# EAGLE design MastModule_v8 (EAGLE 9.6.2)
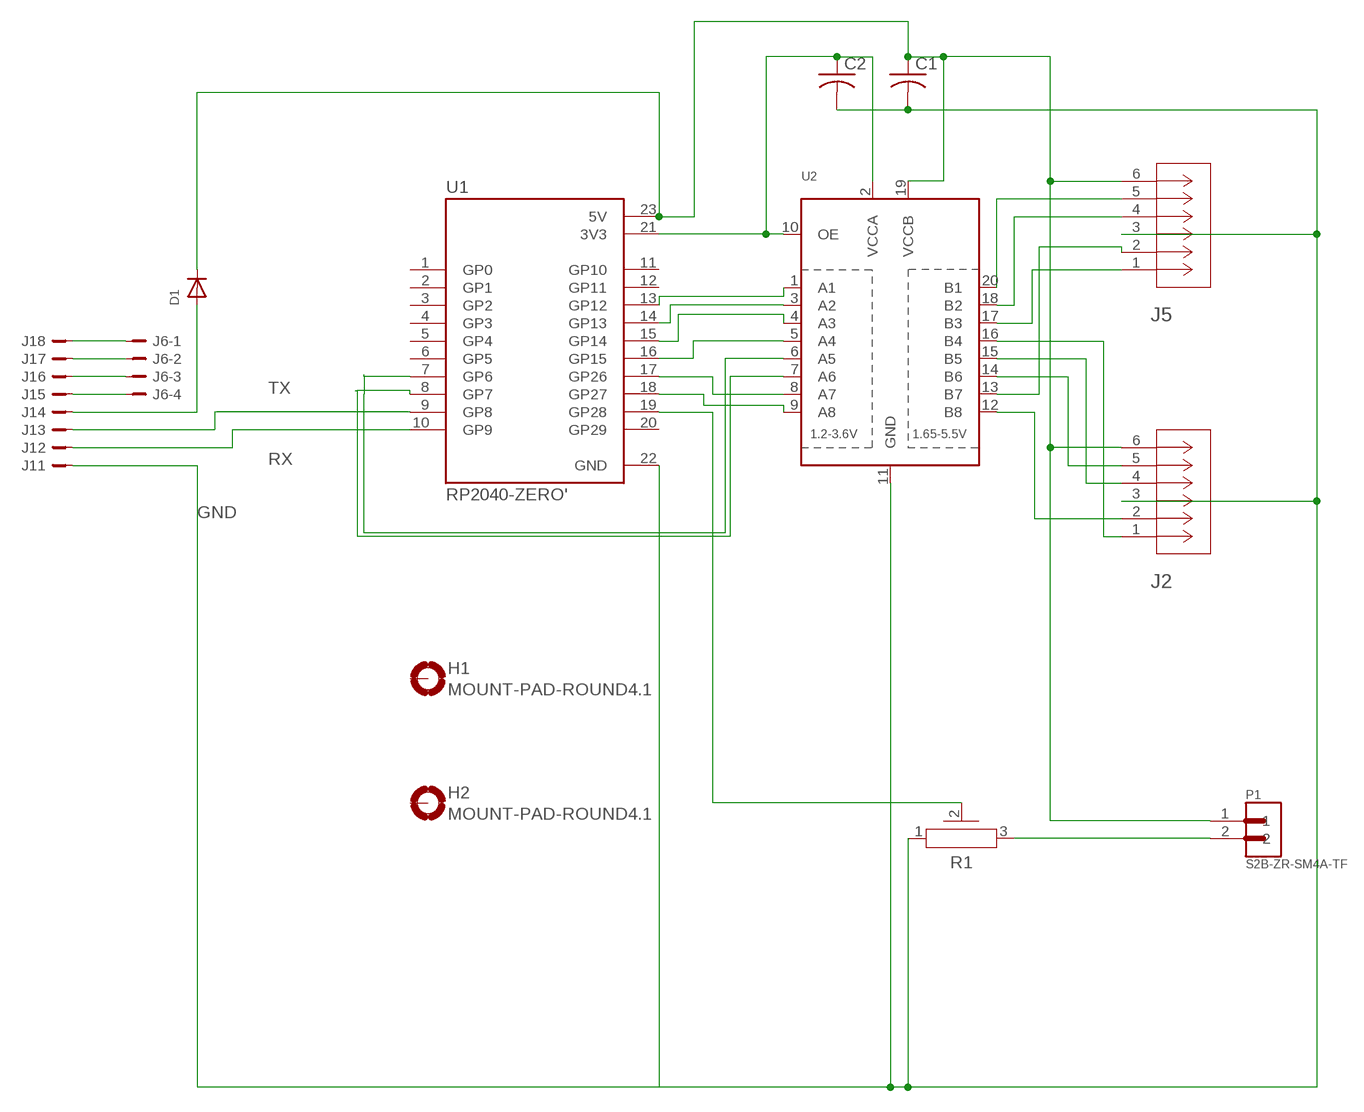
[diagram p0: schematic, sheet 1]

## Parts
C1  C-USC1210  [C1210]
C2  C-USC1210  [C1210]
D1  DIODESMA  [SMADIODE]
H1  MOUNT-PAD-ROUND4.1  [4,1-PAD]
H2  MOUNT-PAD-ROUND4.1  [4,1-PAD]
J1  B8B-PH-K-S  [B8B-PH-K-S]
J2  2132260630CONN_2132260000-SD_06_MOL  [CONN_2132260000-SD_06_MOL]
J5  2132260630CONN_2132260000-SD_06_MOL  [CONN_2132260000-SD_06_MOL]
J6  JST-PH-4_TH-RA  [S4B-PH-KL]
P1  S2B-ZR-SM4A-TF  [JST_S2B-ZR-SM4A-TF]
R1  PV36X  [PV36X]
U1  RP2040-ZERO'  [MODULE_RP2040-ZERO]
U2  TXB0108PWR  [TSSOP20]

## Nets
3V3: C2.1 U1.21(3V3) U2.2(VCCA) U2.10(OE)
5V: C1.1 D1.C J2.6 J5.6 P1.1 U1.23(5V) U2.19(VCCB)
GND: C1.2 C2.2 J1.1 J2.3 J5.3 R1.1 U1.22(GND) U2.11(GND)
N$1: J1.8 J6.1
N$2: J1.7 J6.2
N$3: J1.6 J6.3
N$4: J1.5 J6.4
N$6: D1.A J1.4
N$7: U1.17(GP26) U2.8(A7)
N$8: J5.5 U2.20(B1)
N$9: J5.4 U2.18(B2)
N$10: R1.2 U1.19(GP28)
N$11: P1.2 R1.3
N$12: J5.1 U2.17(B3)
N$13: J2.1 U2.16(B4)
N$14: J2.4 U2.15(B5)
N$15: J2.5 U2.14(B6)
N$16: U1.18(GP27) U2.9(A8)
N$17: J5.2 U2.13(B7)
N$18: J2.2 U2.12(B8)
N$21: U1.8(GP7) U2.7(A6)
N$22: U1.7(GP6) U2.6(A5)
N$23: U1.13(GP12) U2.1(A1)
N$24: U1.14(GP13) U2.3(A2)
N$25: U1.15(GP14) U2.4(A3)
N$26: U1.16(GP15) U2.5(A4)
RX: J1.2 U1.10(GP9)
TX: J1.3 U1.9(GP8)
Unconnected: H1.B4,1(MOUNT) H2.B4,1(MOUNT) U1.1(GP0) U1.2(GP1) U1.3(GP2) U1.4(GP3) U1.5(GP4) U1.6(GP5) U1.11(GP10) U1.12(GP11) U1.20(GP29)

## Library data of the parts
C1 C2 = adafruit:C-US: CAPACITOR, American symbol
D1 = adafruit:DIODE: Diode SMADIODE - SMA Surface Mount Package 20V 1A Schottky Diode Digikey: 641-1014-6-ND DO-1N4148 - Through Hole Small Current Diode SOD-123 20V 1 A (.5mV Vf) Schottky Diode - Digikey: MBRX120TPMSCT-ND SOD-323 10V 570mA (.38mV Vf, 3ns) Schottky Diode - Digikey: ZLLS410CT-ND SOD-523 30V 30mA Schottky Diode (RB751S-40TE61) - Digikey: RB751S-40TE61CT-ND SOT23-R/W - SOT23 Package (R = Solder Paste/Reflow Ovens, W = Hand-Soldering) BAT54Film 40V 300mA - Digikey: 497-7162-1-ND
H1 H2 = holes:MOUNT-PAD-ROUND: MOUNTING PAD, round
J1 = con-JST-PH:B8B-PH-K-S: JST-PH 8-way vertical TH
J2 J5 = 2025-10-01_21-18-46_Library:2132260630; COPYRIGHT: Copyright (C) 2025 Ultra Librarian. All rights reserved.; DATASHEET: https://www.molex.com/en-us/products/part-detail-pdf/2132260630?display=pdf; DESCRIPTION: 1.50mm Pitch CLIK-Mate Wire-to-Board PCB Receptacle, Single Row, Surface Mount, Right-Angle, 0.38µm Gold (Au) Plating, 6 Circuits, Natural; MANUFACTURER_NAME: Molex Connector Corporation; MANUFACTURER_PART_NUMBER: 2132260630
J6 = con-JST-PH:JST-PH-4; MF: JST; MPN: S4B-PH-KL
P1 = S2B-ZR-SM4A-TF:S2B-ZR-SM4A-TF: Check availability <https://pricing.snapeda.com/parts/S2B-ZR-SM4A-TF/JST%20Sales/view-part?ref=eda>; AVAILABILITY: In Stock; CHECK_PRICES: https://www.snapeda.com/parts/S2B-ZR-SM4A-TF/JST/view-part/?ref=eda; DESCRIPTION: Connector Header Surface Mount, Right Angle 2 position 0.059 (1.50mm); MF: JST Sales; MP: S2B-ZR-SM4A-TF; PACKAGE: None; PRICE: None; SNAPEDA_LINK: https://www.snapeda.com/parts/S2B-ZR-SM4A-TF/JST/view-part/?ref=snap
R1 = Resistor:PV36: Rectangular Trimmer Potentiometers - PV36 Series Reference: Datasheet <https://www.bourns.com/docs/Product-Datasheets/pv36.pdf>; CATEGORY: Potentiometers; DATASHEET: https://www.bourns.com/docs/Product-Datasheets/pv36.pdf; DESCRIPTION: 0.5W 1/2W PC Pins Through Hole Trimmer Potentiometer Cermet 25.0 Turn Side Adjustment; MANUFACTURER: Bourns Inc.; MPN: PV36Xx; OPERATING_TEMPERATURE: -55°C ~ 125°C; PACKAGE_SIZE: NA; PACKAGE_TYPE: THT; PART_STATUS: ACTIVE; ROHS: COMPLIANT; SERIES: PV36; SUBCATEGORY: Trimmer Potentiometers; TEMPERATURE_COEFFICIENT: ±100ppm/°C; THERMALLOSS: 0.5 W; TOLERANCE: ±10%; TYPE: Side Adjustment Inline Leads
U1 = RP2040-ZERO:RP2040-ZERO: Check availability <https://pricing.snapeda.com/parts/RP2040-ZERO/Waveshare%20Electronics/view-part?ref=eda>; AVAILABILITY: Not in stock; CHECK_PRICES: https://www.snapeda.com/parts/RP2040-ZERO/Waveshare+Electronics/view-part/?ref=eda; DESCRIPTION: Low-Cost, High-Performance Pico-Like MCU Board Based On Raspberry Pi Microcontroller RP2040; MF: Waveshare Electronics; MP: RP2040-ZERO; PACKAGE: Package; PRICE: None; SNAPEDA_LINK: https://www.snapeda.com/parts/RP2040-ZERO/Waveshare+Electronics/view-part/?ref=snap
U2 = adafruit:TXB0108PWR: 8-Bit Bi-Directional Level Shifter 1.2V-3.6V (VCCA) to 1.65V-5.5V (VCCB) bi-directional level shifter with auto direction sensing. Max data rate - VCCA 1.8V: 20Mbps (50ns), VCCA 3.3V: 100Mbps (10ns) Digikey: 296-21527-1-ND

## Board
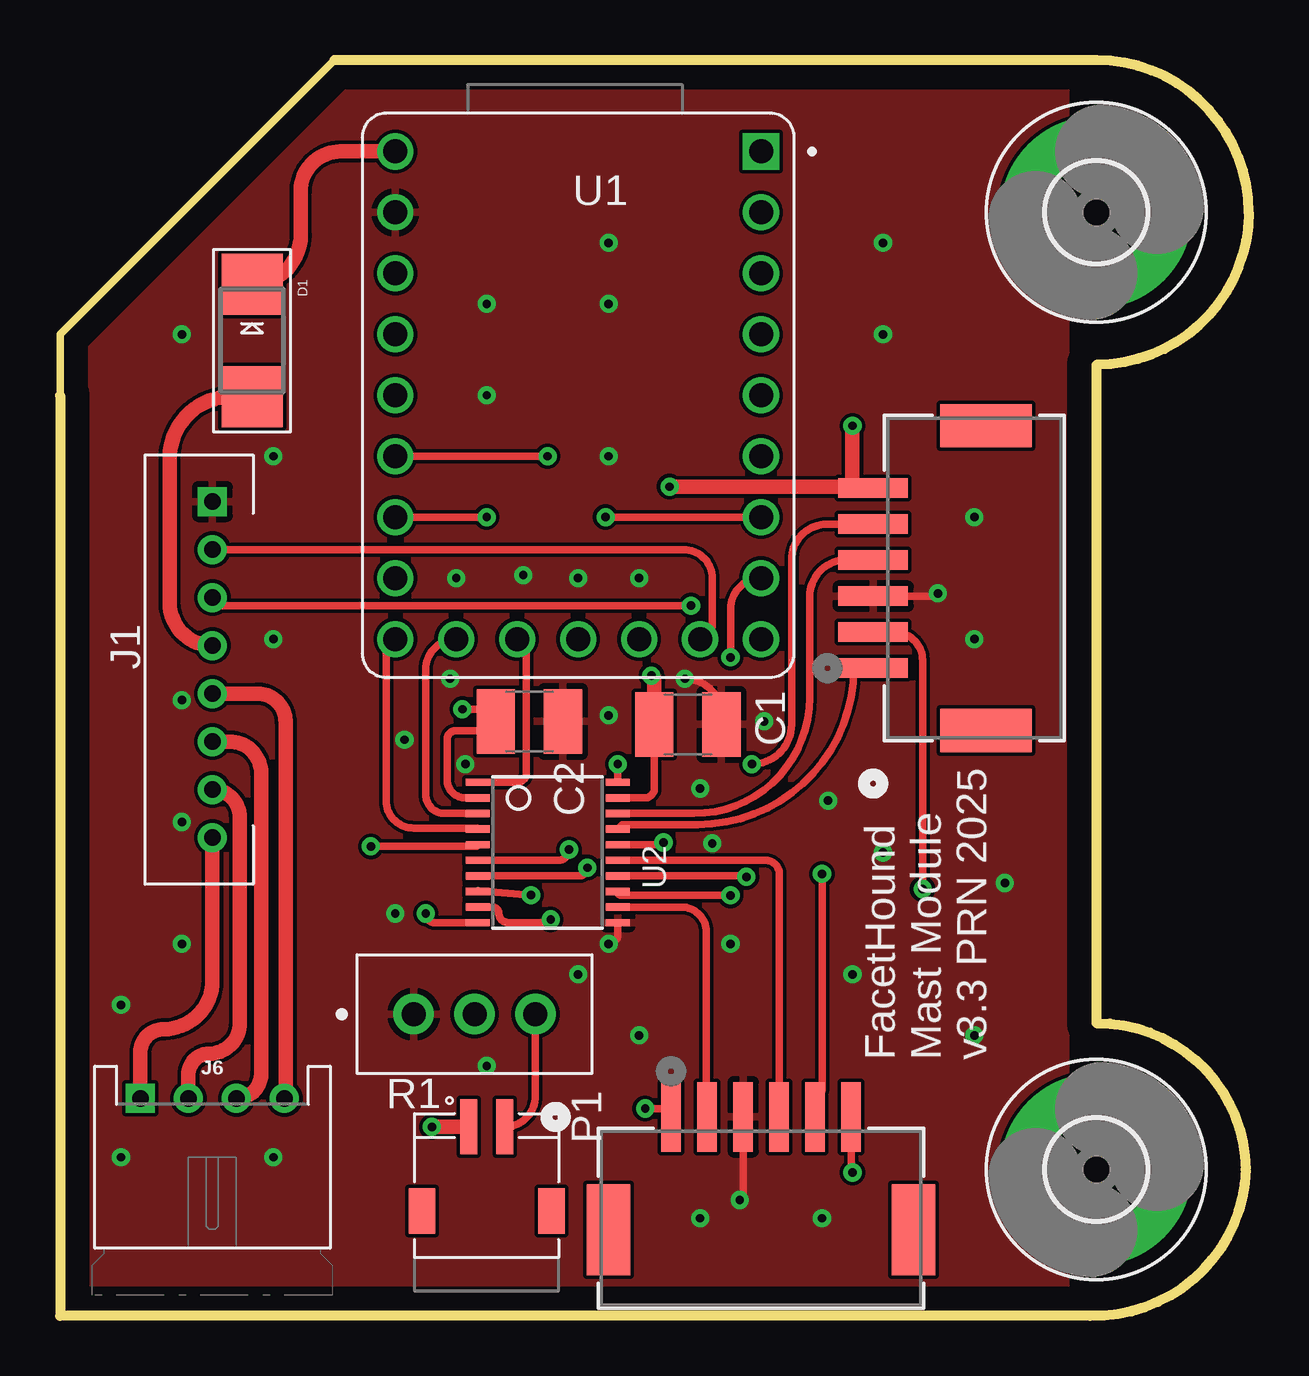
[diagram p1: board, top side]
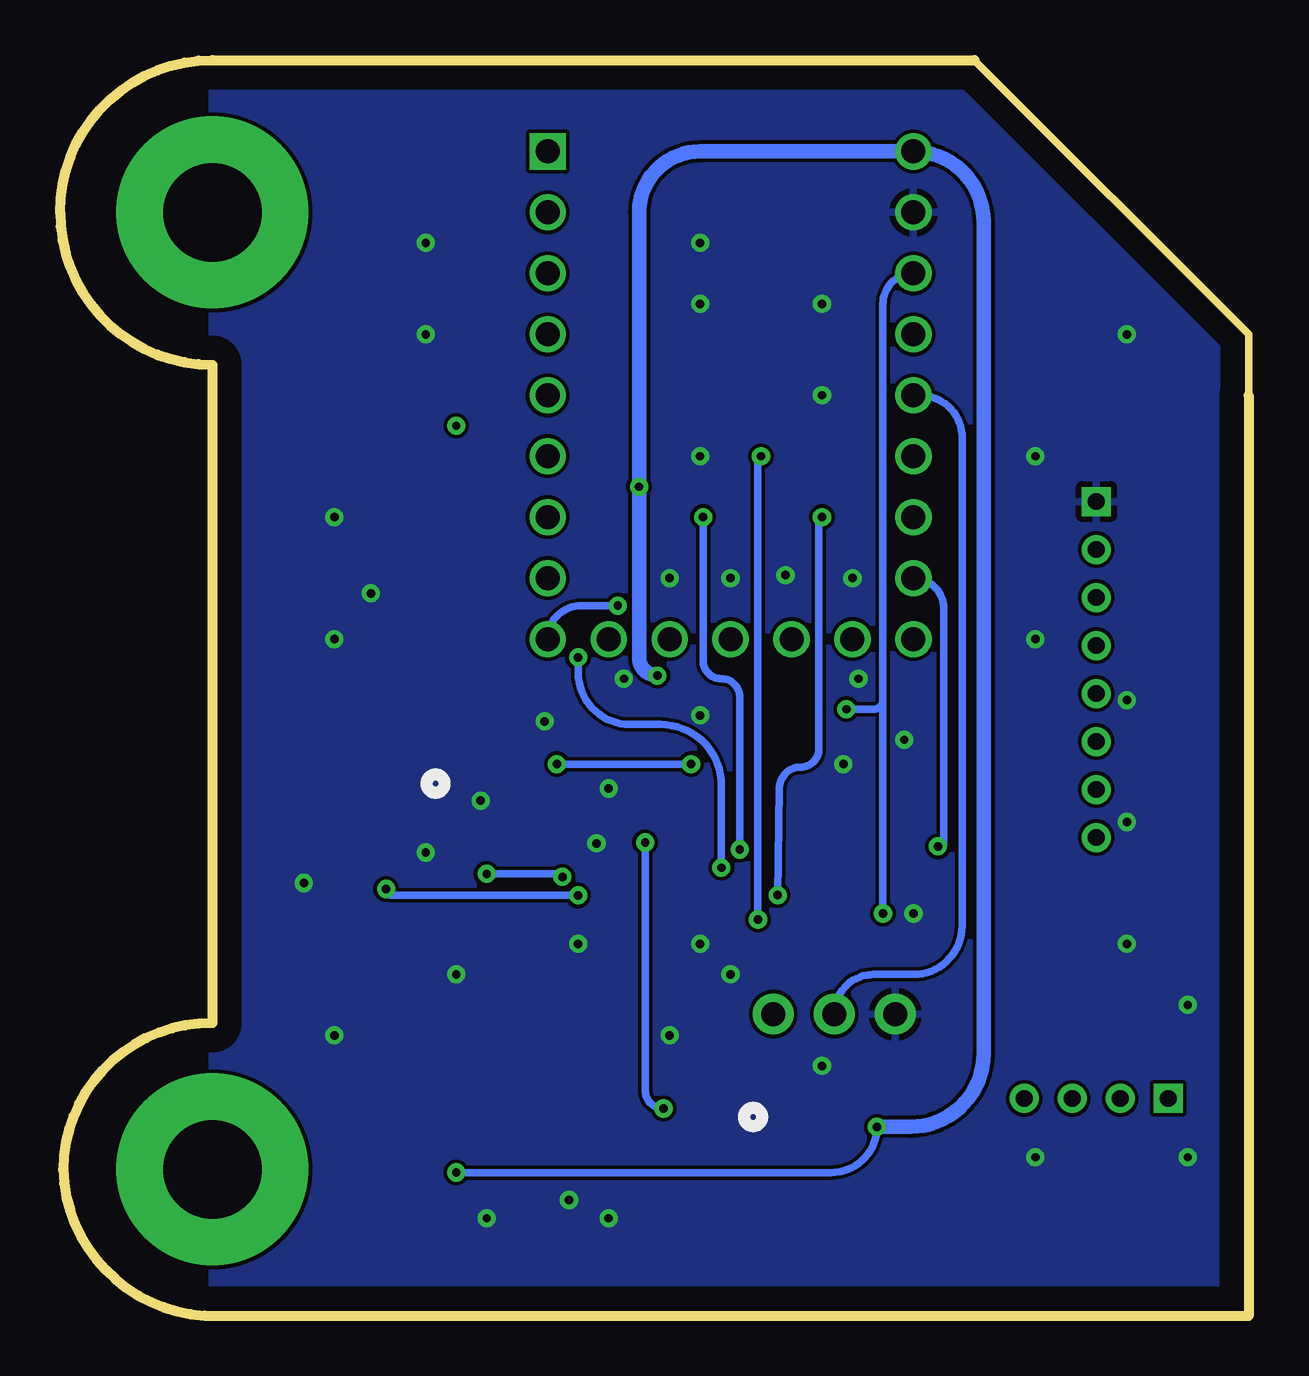
[diagram p2: board, bottom side, seen from below]

Size 49.53 x 52.32 mm. Coordinates in mm from the lower left corner, seen from the top.
Outline: 0,38.35 0,0 42.93,0 arc90 49.4,6.1 arc90 43.18,12.19 43.18,39.62 arc90 49.53,45.97 arc90 43.18,52.32 11.43,52.32 0,40.89 0,38.35
Copper layers (1*16): Top 0.035mm / dielectric 1.5mm / Bottom 0.035mm
Design rules "default": minimum track width 6mil, minimum drill 0.35mm, track to track 6mil, track to pad 6mil, pad to pad 6mil, via to via 6mil, smd to smd 6mil, copper to edge 40mil, drill to drill 6mil, minimum pad ring 10mil, minimum via ring 8mil, stop-mask expansion 4mil, vias tented up to drill 0mil, thermal gap 10mil

### Footprints (pad centres in the part's own frame; a part is rotated, then mirrored left to right if it is on the bottom)
C1210 = smd 1.6 x 2.7: 1 -1.4,0; 2 1.4,0
SMADIODE = smd 2.54 x 2.54: A 2.349,0; C -2.349,0
4,1-PAD = drill 4.1 pad 8: B4,1 0,0
B8B-PH-K-S = drill 0.7 square: 1 7,0 | drill 0.7: 2 5,0; 3 3,0; 4 1,0; 5 -1,0; 6 -3,0; 7 -5,0; 8 -7,0
CONN_2132260000-SD_06_MOL = smd 0.813 x 2.896: 1 -3.75,4.22; 2 -2.25,4.22; 3 -0.75,4.22; 4 0.75,4.22; 5 2.25,4.22; 6 3.75,4.22 | smd 1.803 x 3.81: 7 -6.35,-0.48; 8 6.35,-0.48
S4B-PH-KL = drill 0.7 square: 1 3,-3.72 | drill 0.7: 2 1,-3.72; 3 -1,-3.72; 4 -3,-3.72
JST_S2B-ZR-SM4A-TF = smd 0.7 x 2.3: 1 0.75,0; 2 -0.75,0 | smd 1.1 x 1.9: P1 2.7,3.5; P2 -2.7,3.5
PV36X = drill 1 pad 1.7: 1 0,0; 2 2.54,0; 3 5.08,0
MODULE_RP2040-ZERO = drill 1 square: 1 7.62,10.16 | drill 1: 2 7.62,7.62; 3 7.62,5.08; 4 7.62,2.54; 5 7.62,0; 6 7.62,-2.54; 7 7.62,-5.08; 8 7.62,-7.62; 9 7.62,-10.16; 10 5.08,-10.16; 11 2.54,-10.16; 12 0,-10.16; 13 -2.54,-10.16; 14 -5.08,-10.16; 15 -7.62,-10.16; 16 -7.62,-7.62; 17 -7.62,-5.08; 18 -7.62,-2.54; 19 -7.62,0; 20 -7.62,2.54; 21 -7.62,5.08; 22 -7.62,7.62; 23 -7.62,10.16
TSSOP20 = smd 0.305 x 0.991: 1 -2.925,-2.918; 2 -2.275,-2.918; 3 -1.625,-2.918; 4 -0.975,-2.918; 5 -0.325,-2.918; 6 0.325,-2.918; 7 0.975,-2.918; 8 1.625,-2.918; 9 2.275,-2.918; 10 2.925,-2.918; 11 2.925,2.918; 12 2.275,2.918; 13 1.625,2.918; 14 0.975,2.918; 15 0.325,2.918; 16 -0.325,2.918; 17 -0.975,2.918; 18 -1.625,2.918; 19 -2.275,2.918; 20 -2.925,2.918

### Placement (x,y rotation side)
C1  26.16,24.64 0 top
C2  19.56,24.77 0 top
D1  8,40.64 270 top
H1  43.18,45.97 0 top
H2  43.18,6.1 0 top
J1  6.35,26.92 90 top
J2  29.21,4.06 0 top
J5  38.1,30.73 90 top
J6  6.35,5.33 180 top
P1  17.78,7.87 180 top
R1  14.73,12.57 0 top
U1  21.59,38.35 0 top
U2  20.32,19.3 270 top

### Tracks (layer width: path | path; a pad name or v marks a point on that pad's centre or on a via)
3V3  (via drill 0.35)
  Top 0.305: U2.2 16.9,21.58 arc-90 16.13,22.35 16.13,24 arc-90 16.51,24.38 17.78,24.38 arc90 C2.1 arc90 17.65,25.27 v16.76,25.27 | v15.24,16.76 arc90 15.62,16.38 U2.10
  Bottom 0.305: U1.21 arc-90 15.24,42.16 15.24,25.65 | 15.24,25.65 arc90 15.62,25.27 v16.76,25.27 | 15.24,25.65 v15.24,16.76
5V  (via drill 0.35)
  Top 0.305: v33.02,5.97 arc-90 32.96,6.03 J2.6 | U2.19 24.37,21.58 arc90 24.77,21.97 C1.1 arc90 C1.1
  Top 0.61: v15.49,7.87 P1.1 | v33.02,37.08 33.02,34.54 arc90 33.08,34.48 J5.6 arc90 33.82,34.54 v25.4,34.54 | D1.C arc90 10.03,45.02 10.03,46.86 arc-90 11.68,48.51 U1.23 | C1.1 24.76,26.55 | 24.76,26.55 arc90 v24.64,26.67 arc-90 24.76,26.55
  Bottom 0.305: v15.49,7.87 arc90 17.4,5.97 v33.02,5.97
  Bottom 0.61: v15.49,7.87 14.1,7.87 arc-90 11.05,10.92 11.05,45.59 arc-90 U1.23 22.86,48.51 arc-90 25.4,45.97 v25.4,34.54 25.4,34.16 25.4,27.43 arc-90 v24.64,26.67
GND  (via drill 0.35)
  Top 0.305: 34.54,29.97 33.89,29.97 arc-90 J5.3 36.46,29.98 arc90 v36.58,30.1 | U2.11 23.24,15.87 arc-90 v22.86,15.49 | J2.3 28.46,4.97 arc-90 v28.32,4.83 | C2.2 arc90 21.34,25.14 | C1.2 27.56,25.02 arc90 v26.04,26.54
  other vias: 34.29,44.7 34.29,40.89 17.78,42.16 22.86,42.16 22.86,44.7 17.78,38.35 8.89,35.81 5.08,40.89 22.86,35.81 8.89,28.19 5.08,25.65 5.08,20.57 5.08,15.49 2.54,12.95 2.54,6.6 8.89,6.6 13.97,16.76 17.78,10.41 24.13,11.68 21.59,14.22 27.94,15.49 26.67,4.06 31.75,4.06 33.02,14.22 38.1,11.68 39.37,18.03 34.29,19.3 38.1,28.19 38.1,33.27 29.34,24.77 22.86,25.02 16.51,30.73 19.3,30.86 21.59,30.73 24.13,30.73 16.26,26.54 16.89,22.99 32,21.46 26.67,21.97 27.18,19.68 14.35,24
  pour Bottom: 11.43,52.32 0,40.89 0,0.25 43.18,0.25 43.18,52.32
  pour Top: 0,40.89 11.43,52.32 41.91,52.32 41.91,0.25 0,0.25
N$1
  Top 0.61: J1.8 6.35,13.97 arc-90 4.32,11.94 arc90 3.35,10.97 J6.1
N$2
  Top 0.61: J1.7 arc-90 7.49,20.78 7.49,12.19 arc-90 6.22,10.92 arc90 5.35,10.05 J6.2
N$3
  Top 0.61: J1.6 7.06,23.92 arc-90 8.38,22.61 8.38,10.09 arc-90 J6.3
N$4
  Top 0.61: J1.5 8.24,25.92 arc-90 9.4,24.77 9.4,9.1 arc-90 J6.4
N$6
  Top 0.61: J1.4 arc-90 4.57,29.7 4.57,35.75 arc-90 7.11,38.29 D1.A
N$7  (via drill 0.35)
  Top 0.305: U1.17 v17.78,33.27 | v19.63,17.53 17.44,17.71 arc90 U2.8
  Bottom 0.305: v17.78,33.27 arc-90 17.91,33.15 17.91,23.62 arc90 18.67,22.86 arc-90 19.56,21.97 v19.63,17.53
N$8  (via drill 0.35)
  Top 0.305: J5.5 31.97,32.98 arc90 30.48,31.5 30.48,24.64 arc-90 v28.83,22.99 | U2.20 v23.24,22.98 arc-90 v23.24,22.99
  Bottom 0.305: v23.24,22.99 v28.83,22.99
N$9
  Top 0.305: J5.4 arc90 33.87,31.5 32.77,31.5 arc90 31.24,29.97 31.24,25.75 arc-90 26.42,20.93 U2.18
N$10
  Bottom 0.305: U1.19 13.72,38.35 arc90 11.94,36.58 11.94,16.26 arc90 13.97,14.22 15.62,14.22 arc-90 R1.2
N$11
  Top 0.305: P1.2 arc90 19.81,9.16 R1.3
N$12
  Top 0.305: U2.17 23.43,20.47 26.57,20.47 arc90 33.08,26.98 J5.1
N$13  (via drill 0.35)
  Top 0.305: v25.15,19.72 25.05,19.63 U2.16 | v24.38,8.64 25.11,8.64 arc-90 J2.1
  Bottom 0.305: v25.15,19.72 25.15,9.4 arc-90 v24.38,8.64
N$14
  Top 0.305: U2.15 23.17,18.98 | U2.15 23.44,18.98 | J2.4 arc90 29.97,8.3 29.97,18.41 arc90 29.41,18.98 U2.15
N$15  (via drill 0.35)
  Top 0.305: 31.37,8.37 arc90 J2.5 arc90 31.5,8.32 31.5,9.14 31.75,9.4 v31.75,18.41 | U2.14 28.56,18.33 arc-90 v28.6,18.29
  Bottom 0.305: v31.75,18.41 28.73,18.41 v28.6,18.29
N$16  (via drill 0.35)
  Top 0.305: U1.18 v20.32,35.81 | U2.9 18.02,17.03 arc-90 18.29,16.76 arc90 18.67,16.38 20.32,16.38 arc90 v20.45,16.51
  Bottom 0.305: v20.32,35.81 20.45,35.69 v20.45,16.51
N$17  (via drill 0.35)
  Top 0.305: 35.14,28.48 34.76,28.48 | v35.94,17.78 35.94,27.3 arc90 34.76,28.48 | 34.76,28.48 J5.2 | U2.13 arc90 23.4,17.52 v27.94,17.52
  Bottom 0.305: v27.94,17.52 35.68,17.52 arc90 v35.94,17.78
N$18
  Top 0.305: U2.12 25.9,17.03 arc-90 26.92,16 26.92,8.32 arc90 J2.2
N$21  (via drill 0.35)
  Top 0.305: U1.8 arc90 27.94,29.46 v27.94,27.43 | U2.7 21.63,18.33 arc90 v21.97,18.67
  Bottom 0.305: v21.97,18.67 21.97,21.84 21.97,22.1 arc-90 24.51,24.64 25.78,24.64 arc90 27.94,26.8 v27.94,27.43
N$22  (via drill 0.35)
  Top 0.305: U2.6 20.76,18.98 arc90 v21.21,19.43 | v22.73,33.27 U1.7
  Bottom 0.305: v21.21,19.43 21.21,25.78 arc-90 21.97,26.54 arc90 22.73,27.3 v22.73,33.27
N$23
  Top 0.305: U2.1 arc90 U2.1 19.05,22.23 arc90 19.43,22.61 19.43,27.81 arc90 U1.13
N$24
  Top 0.305: U1.14 arc90 15.24,26.92 15.24,21.72 arc90 16.03,20.93 U2.3
N$25
  Top 0.305: U1.15 13.59,27.81 13.59,21.46 arc90 14.73,20.32 17.36,20.32 arc-90 U2.4
N$26  (via drill 0.35)
  Top 0.305: U2.5 arc-90 17.33,19.56 v12.95,19.56
  Bottom 0.305: U1.16 arc90 12.7,29.46 12.7,19.68 arc90 12.83,19.56 v12.95,19.56
RX
  Top 0.305: J1.2 25.99,31.92 arc-90 27.18,30.73 27.18,28.7 U1.10
TX  (via drill 0.35)
  Top 0.305: J1.3 arc90 6.68,29.59 v26.29,29.59
  Bottom 0.305: v26.29,29.59 27.81,29.59 arc-90 U1.9

### Text on the board
tPlace: FacetHound / Mast Module / v3.3 PRN 2025